# EAGLE design Qwiic Shield for RaspberryPi (EAGLE 7.7.0)
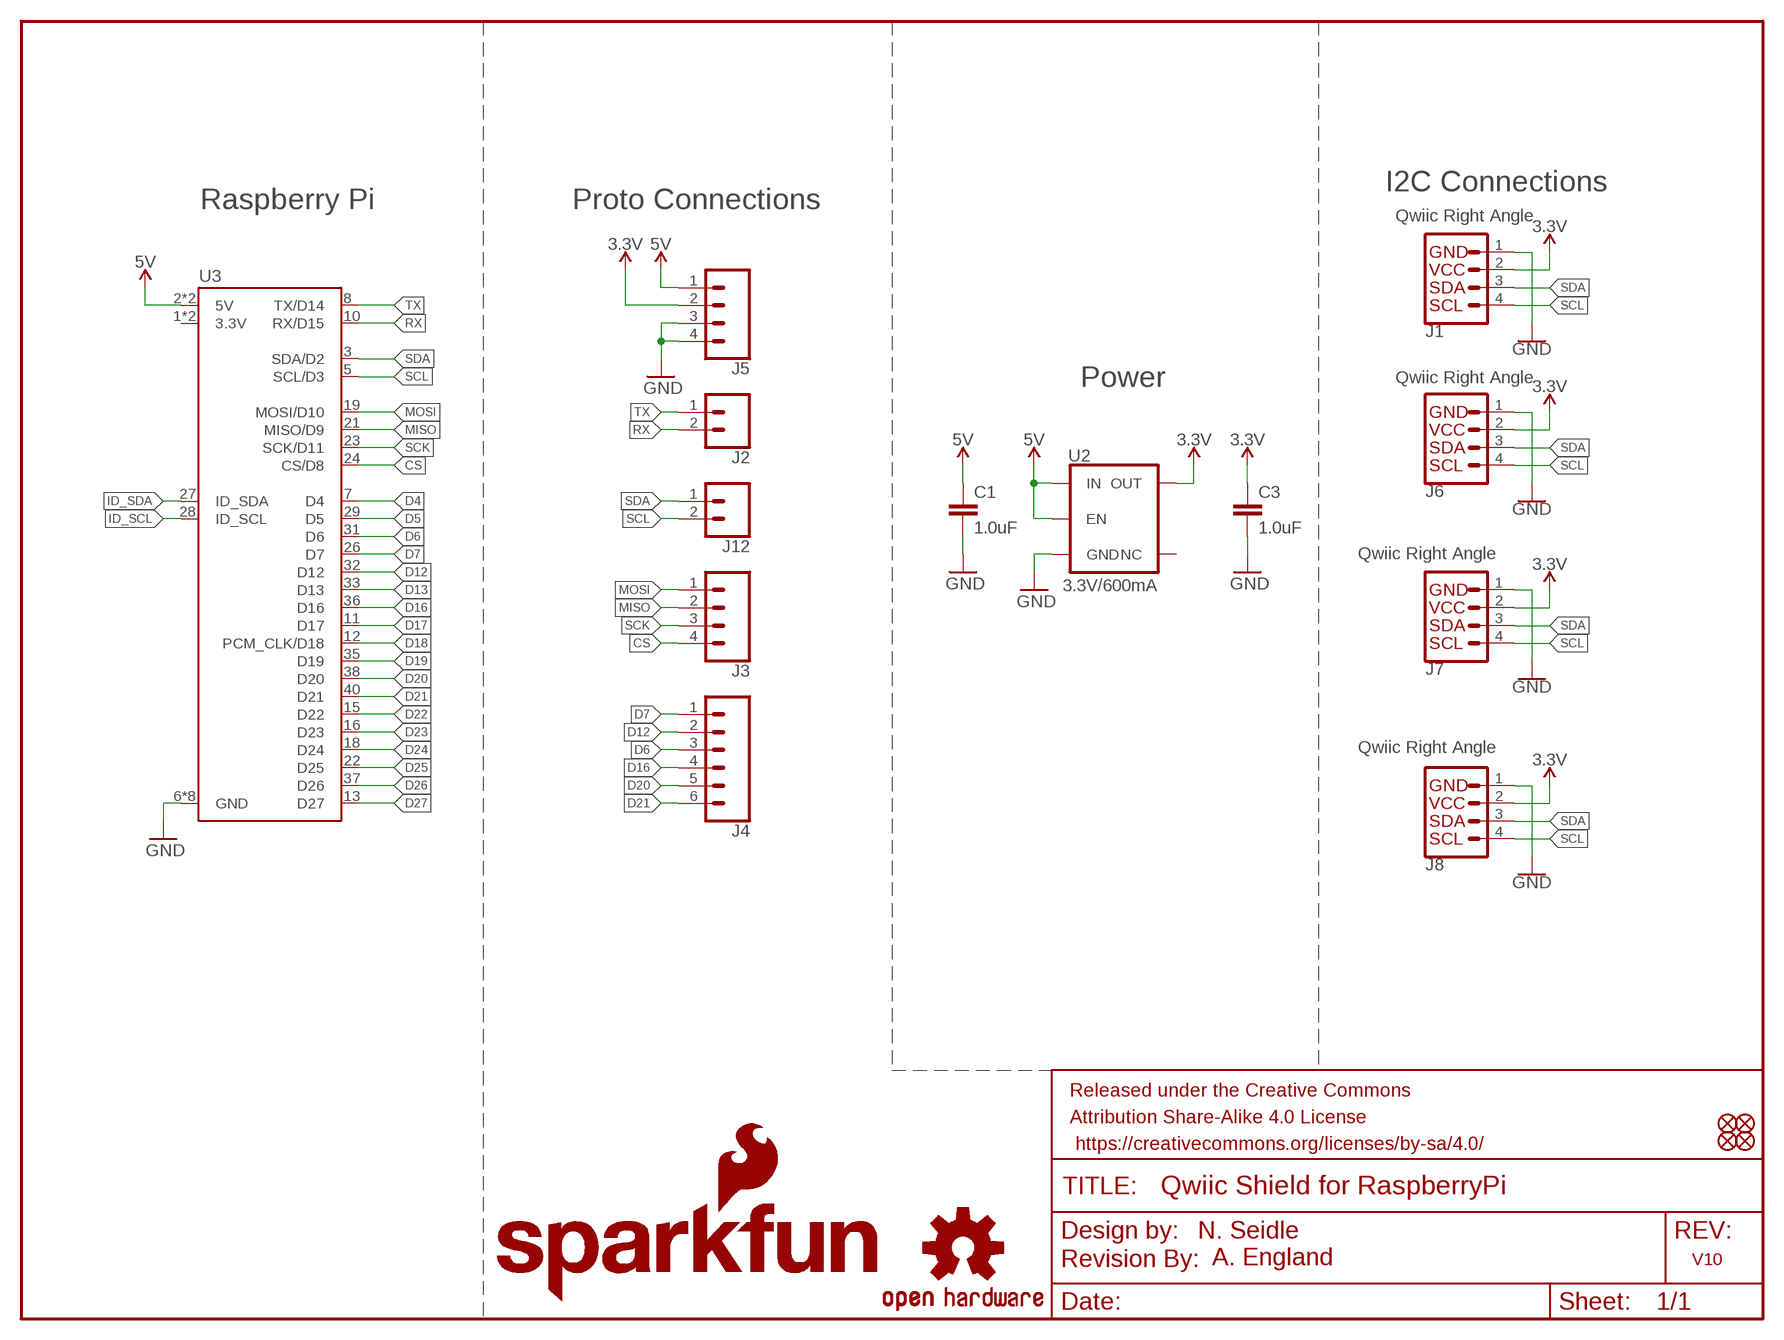
[diagram p0: schematic, sheet 1]

## Parts
C1  1.0uF  1.0UF-0603-16V-10%  [0603]
C3  1.0uF  1.0UF-0603-16V-10%  [0603]
FD1  FIDUCIAL1X2  [FIDUCIAL-1X2]
FD2  FIDUCIAL1X2  [FIDUCIAL-1X2]
FD3  FIDUCIAL1X2  [FIDUCIAL-1X2]
FD4  FIDUCIAL1X2  [FIDUCIAL-1X2]
FRAME1  FRAME-LETTER  [CREATIVE_COMMONS]
J1  Qwiic Right Angle  I2C_STANDARDQWIIC  [1X04_1MM_RA]
J2  CONN_021X02_NO_SILK  [1X02_NO_SILK]
J3  CONN_041X04_NO_SILK  [1X04_NO_SILK]
J4  CONN_06NO_SILK_FEMALE_PTH  [1X06_NO_SILK]
J5  CONN_041X04_NO_SILK  [1X04_NO_SILK]
J6  Qwiic Right Angle  I2C_STANDARDQWIIC  [1X04_1MM_RA]
J7  Qwiic Right Angle  I2C_STANDARDQWIIC  [1X04_1MM_RA]
J8  Qwiic Right Angle  I2C_STANDARDQWIIC  [1X04_1MM_RA]
J12  CONN_021X02_NO_SILK  [1X02_NO_SILK]
LOGO1  OSHW-LOGOMINI  [OSHW-LOGO-MINI]
LOGO2  REVISION  [REVISION]
U2  3.3V/600mA  V_REG_AP2112K-3.3V  [SOT23-5]
U3  RASPBERRY_PI_40BTM-NOHOLES  [RASPBERRY_PI_SHIELD_BOTTOM_ENTRY_NOHOLES]
U$1  SFE_LOGO_FLAME.1_INCH  [SFE_LOGO_FLAME_.1]
U$2  SFE_LOGO_NAME.1_INCH  [SFE_LOGO_NAME_.1]

## Nets
3.3V: C3.1 J1.2 J5.2 J6.2 J7.2 J8.2 U2.5(OUT)
5V: C1.1 J5.1 U2.1(IN) U2.3(EN) U3.2(5V) U3.4(5V)
CS: J3.4 U3.24(CS/D8)
D4: U3.7(D4)
D5: U3.29(D5)
D6: J4.3 U3.31(D6)
D7: J4.1 U3.26(D7)
D12: J4.2 U3.32(D12)
D13: U3.33(D13)
D16: J4.4 U3.36(D16)
D17: U3.11(D17)
D18: U3.12(PCM_CLK/D18)
D19: U3.35(D19)
D20: J4.5 U3.38(D20)
D21: J4.6 U3.40(D21)
D22: U3.15(D22)
D23: U3.16(D23)
D24: U3.18(D24)
D25: U3.22(D25)
D26: U3.37(D26)
D27: U3.13(D27)
GND [vcc]: C1.2 C3.2 J1.1 J5.3 J5.4 J6.1 J7.1 J8.1 U2.2(GND) U3.6(GND) U3.9(GND) U3.14(GND) U3.20(GND) U3.25(GND) U3.30(GND) U3.34(GND) U3.39(GND)
ID_SCL: U3.28(ID_SCL)
ID_SDA: U3.27(ID_SDA)
MISO: J3.2 U3.21(MISO/D9)
MOSI: J3.1 U3.19(MOSI/D10)
RX: J2.2 U3.10(RX/D15)
SCK: J3.3 U3.23(SCK/D11)
SCL: J1.4 J6.4 J7.4 J8.4 J12.2 U3.5(SCL/D3)
SDA: J1.3 J6.3 J7.3 J8.3 J12.1 U3.3(SDA/D2)
TX: J2.1 U3.8(TX/D14)
Unconnected: U2.4(NC) U3.1(3.3V) U3.17(3.3V)

## Notes on the sheet
- I2C Connections
- Raspberry Pi | Proto Connections
- Power
- N. Seidle
- A. England | V10

## Library data of the parts
C1 C3 = SparkFun-Capacitors:1.0UF: 1µF ceramic capacitors A capacitor is a passive two-terminal electrical component used to store electrical energy temporarily in an electric field.; PROD_ID: CAP-00868
FD1-FD4 = SparkFun-Aesthetics:FIDUCIAL: Fiducial Alignment Points Various fiducial points for machine vision alignment.
FRAME1 = SparkFun-Aesthetics:FRAME-LETTER: Schematic Frame Standard 8.5x11 US Letter frame
J1 J6-J8 = SparkFun-Connectors:I2C_STANDARD: SparkFun I2C Standard Pinout Header SparkFun has standardized on a pinout for all I2C based sensor breakouts. This pinout allows I2C boards to be plugged directly into the headers on Arduino Uno compatible boards, and to be daisy chained easily. Example SparkFun Products: SparkFun Atmospheric Sensor Breakout - BME280 <https://www.sparkfun.com/products/13676> SparkFun Altitude/Pressure Sensor Breakout - MPL3115A2 <https://www.sparkfun.com/products/11084> SparkFun TOF Range Finder Sensor - VL6180 <https://www.sparkfun.com/products/12785>; PROD_ID: CONN-13694
J2 J12 = SparkFun-Connectors:CONN_02: Multi connection point. Often used as Generic Header-pin footprint for 0.1 inch spaced/style header connections On any of the 0.1 inch spaced packages, you can populate with these: Break Away Headers - Straight <https://www.sparkfun.com/products/116> (PRT-00116) Break Away Male Headers - Right Angle <https://www.sparkfun.com/products/553> (PRT-00553) Female Headers <https://www.sparkfun.com/products/115> (PRT-00115) Break Away Headers - Machine Pin <https://www.sparkfun.com/products/117> (PRT-00117) Break Away Female Headers - Swiss Machine Pin <https://www.sparkfun.com/products/743> (PRT-00743) For SCREWTERMINALS and SPRING TERMINALS visit here: Screw Terimnals on SparkFun.com <https://www.sparkfun.com/search/results?term=Screw+Terminals> (5mm/3.5mm/2.54mm spacing) This device is also useful as a general connection point to wire up your design to another part of your project. Our various solder wires solder well into these plated through hole pads. Hook-Up Wire - Assortment (Stranded, 22 AWG) <https://www.sparkfun.com/products/11375> (PRT-11375) Hook-Up Wire - Assortment (Solid Core, 22 AWG) <https://www.sparkfun.com/products/11367> (PRT-11367) View the entire wire category on our website here <https://www.sparkfun.com/categories/141> Special notes: Molex polarized connector foot print use with: PRT-08233 with associated crimp pins and housings. 2.54_SCREWTERM for use with PRT-10571. 3.5mm Screw Terminal footprints for PRT-08084 5mm Screw Terminal footprints for use with PRT-08432
J3 J5 = SparkFun-Connectors:CONN_04: Multi connection point. Often used as Generic Header-pin footprint for 0.1 inch spaced/style header connections On any of the 0.1 inch spaced packages, you can populate with these: Break Away Headers - Straight <https://www.sparkfun.com/products/116> (PRT-00116) Break Away Male Headers - Right Angle <https://www.sparkfun.com/products/553> (PRT-00553) Female Headers <https://www.sparkfun.com/products/115> (PRT-00115) Break Away Headers - Machine Pin <https://www.sparkfun.com/products/117> (PRT-00117) Break Away Female Headers - Swiss Machine Pin <https://www.sparkfun.com/products/743> (PRT-00743) For SCREWTERMINALS and SPRING TERMINALS visit here: Screw Terimnals on SparkFun.com <https://www.sparkfun.com/search/results?term=Screw+Terminals> (5mm/3.5mm/2.54mm spacing) This device is also useful as a general connection point to wire up your design to another part of your project. Our various solder wires solder well into these plated through hole pads. Hook-Up Wire - Assortment (Stranded, 22 AWG) <https://www.sparkfun.com/products/11375> (PRT-11375) Hook-Up Wire - Assortment (Solid Core, 22 AWG) <https://www.sparkfun.com/products/11367> (PRT-11367) View the entire wire category on our website here <https://www.sparkfun.com/categories/141> Special notes: Molex polarized connector foot print use with SKU : PRT-08231 with associated crimp pins and housings. 1MM SMD Version SKU: PRT-10208; PROD_ID: CONN-09696
J4 = SparkFun-Connectors:CONN_06: Multi connection point. Often used as Generic Header-pin footprint for 0.1 inch spaced/style header connections On any of the 0.1 inch spaced packages, you can populate with these: Break Away Headers - Straight <https://www.sparkfun.com/products/116> (PRT-00116) Break Away Male Headers - Right Angle <https://www.sparkfun.com/products/553> (PRT-00553) Female Headers <https://www.sparkfun.com/products/115> (PRT-00115) Break Away Headers - Machine Pin <https://www.sparkfun.com/products/117> (PRT-00117) Break Away Female Headers - Swiss Machine Pin <https://www.sparkfun.com/products/743> (PRT-00743) Arduino Stackable Header - 6 Pin <https://www.sparkfun.com/products/9280> (PRT-09280) For SCREWTERMINALS and SPRING TERMINALS visit here: Screw Terimnals on SparkFun.com <https://www.sparkfun.com/search/results?term=Screw+Terminals> (5mm/3.5mm/2.54mm spacing) This device is also useful as a general connection point to wire up your design to another part of your project. Our various solder wires solder well into these plated through hole pads. Hook-Up Wire - Assortment (Stranded, 22 AWG) <https://www.sparkfun.com/products/11375> (PRT-11375) Hook-Up Wire - Assortment (Solid Core, 22 AWG) <https://www.sparkfun.com/products/11367> (PRT-11367) View the entire wire category on our website here <https://www.sparkfun.com/categories/141>; PROD_ID: CONN-08437
LOGO1 = SparkFun-Aesthetics:OSHW-LOGO: Open Source Hardware Logo This logo indicates the piece of hardware it is found on incorporates a OSHW license and/or adheres to the definition of open source hardware found here: http://freedomdefined.org/OSHW
LOGO2 = SparkFun-Aesthetics:REVISION: "Revision By" Text Preceding text for revisor documentation. Includes schematic text on "symbols" layer, and board text on tDoc.
U2 = SparkFun-IC-Power:V_REG_AP2112: AP2112 - 600mA CMOS LDO Regulator w/ Enable The AP2112 is CMOS process low dropout linear regulator with enable function, the regulator delivers a guaranteed 600mA (min.) continuous load current. Features Output Voltage Accuracy: ±1.5% Output Current: 600mA (Min.) Foldback Short Current Protection: 50mA Enable Function to Turn ON/OFF VOUT Low Dropout Voltage (3.3V): 250mV (Typ.) @IOUT=600mA Excellent Load Regulation: 0.2%/A (Typ.) Excellent Line Regulation: 0.02%/V (Typ.) Low Quiescent Current: 55μA (Typ.) Low Standby Current: 0.01μA (Typ.) Low Output Noise: 50μVRMS PSRR: 100Hz -65dB, 1kHz -65dB OTSD Protection Stable with 1.0μF Flexible Cap: Ceramic, Tantalum and Aluminum Electrolytic Operation Temperature Range: -40°C to 85°C ESD: MM 400V, HBM 4000V; PROD_ID: VREG-12457; VALUE: 3.3V
U3 = SparkFun-Connectors:RASPBERRY_PI_40; PROD_ID: CONN-13790
U$1 = SparkFun-Aesthetics:SFE_LOGO_FLAME: SparkFun Flame Logo This is the SparkFun flame logo. The logo on the schematic will always be the same size; the package variant is the height of the flame. Default layer for the logo on the board is tSilk.
U$2 = SparkFun-Aesthetics:SFE_LOGO_NAME: SparkFun Font Logo This is the SparkFun name logo. The logo on the schematic will always be the same size; the package variant is the height of the flame part of the logo (or the height the flame would be, if it were drawn). Default layer for the logo on the board is tSilk.

## Net classes
0 Default: width 0.178 mm
1 vcc: width 0.178 mm

## Board
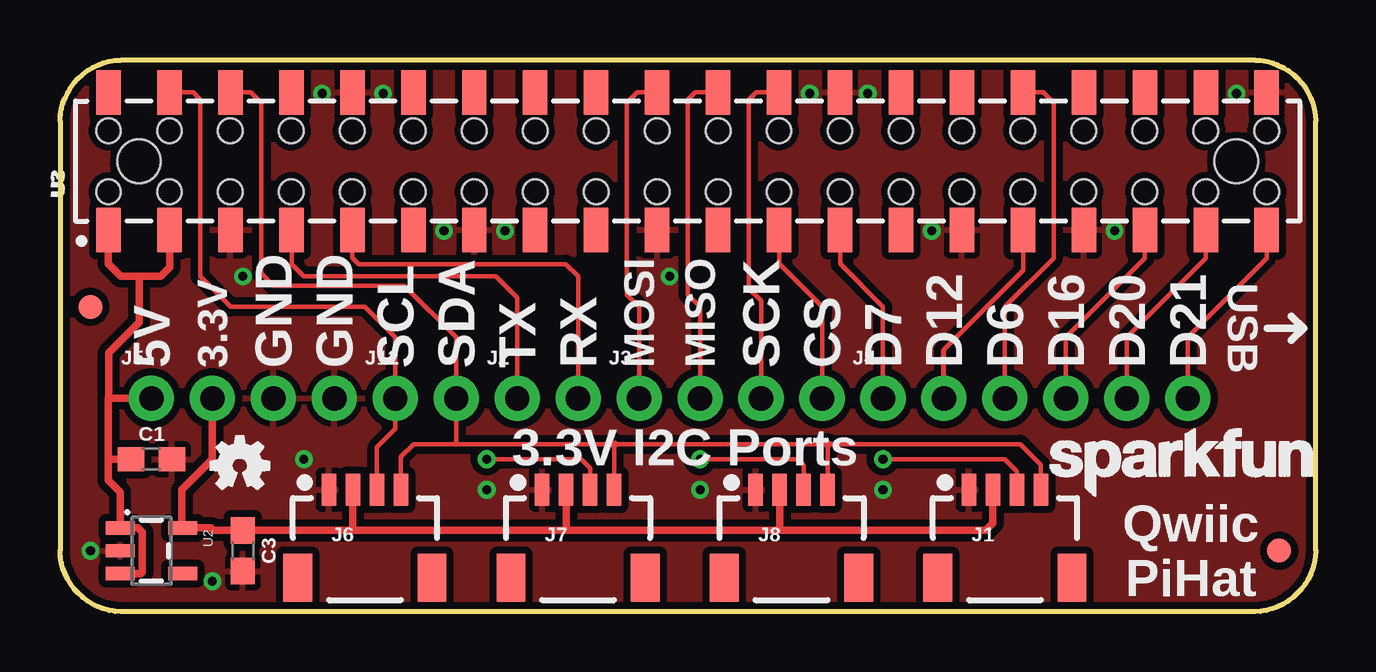
[diagram p1: board, top side]
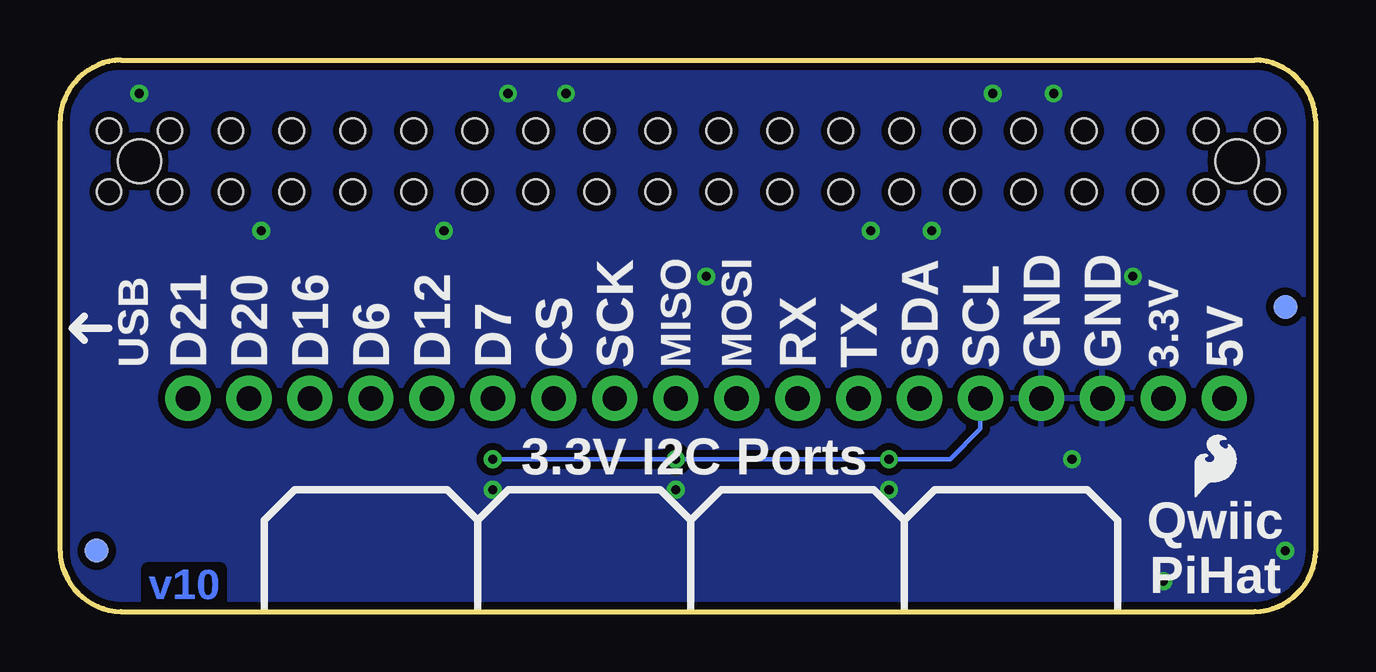
[diagram p2: board, bottom side, seen from below]

Size 52.32 x 22.99 mm. Coordinates in mm from the lower left corner, seen from the top.
Outline: 0,20.45 0,2.54 arc87 2.54,0 49.78,0 arc87 52.32,2.54 52.32,20.45 arc87 49.78,22.99 2.54,22.99 arc87 0,20.45
Copper layers (1*16): Top 0.035mm / dielectric 1.5mm / Bottom 0.035mm
Design rules "SparkFun-2-layer-TIGHT *": minimum track width 7mil, minimum drill 15mil, track to track 6mil, track to pad 6mil, pad to pad 6mil, via to via 6mil, smd to smd 6mil, copper to edge 7mil, drill to drill 7mil, minimum pad ring 7mil, minimum via ring 7mil, stop-mask expansion 4mil, vias tented up to drill 25mil, thermal gap 10mil

### Footprints (pad centres in the part's own frame; a part is rotated, then mirrored left to right if it is on the bottom)
0603 = smd 1.1 x 1: 1 -0.85,0; 2 0.85,0
FIDUCIAL-1X2 = smd 1 x 1: 1 0,0
1X04_1MM_RA = smd 0.6 x 1.35: 1 -1.5,0; 2 -0.5,0; 3 0.5,0; 4 1.5,0 | smd 1.2 x 2: NC1 2.8,-3.675; NC2 -2.8,-3.675
1X02_NO_SILK = drill 1.016 pad 1.88: 1 0,0; 2 2.54,0
1X04_NO_SILK = drill 1.016 pad 1.88: 1 0,0; 2 2.54,0; 3 5.08,0; 4 7.62,0
1X06_NO_SILK = drill 1.016 pad 1.88: 1 0,0; 2 2.54,0; 3 5.08,0; 4 7.62,0; 5 10.16,0; 6 12.7,0
SOT23-5 = smd 0.55 x 1.2: 1 -0.95,-1.3; 2 0,-1.3; 3 0.95,-1.3; 4 0.95,1.3; 5 -0.95,1.3
RASPBERRY_PI_SHIELD_BOTTOM_ENTRY_NOHOLES = smd 1.02 x 1.87: 1 8.37,7.665; 2 8.37,1.935; 3 10.91,7.665; 4 10.91,1.935; 5 13.45,7.665; 6 13.45,1.935; 7 15.99,7.665; 8 15.99,1.935; 9 18.53,7.665; 10 18.53,1.935; 11 21.07,7.665; 12 21.07,1.935; 13 23.61,7.665; 14 23.61,1.935; 15 26.15,7.665; 16 26.15,1.935; 17 28.69,7.665; 18 28.69,1.935; 19 31.23,7.665; 20 31.23,1.935; 21 33.77,7.665; 22 33.77,1.935; 23 36.31,7.665; 24 36.31,1.935; 25 38.85,7.665; 26 38.85,1.935; 27 41.39,7.665; 28 41.39,1.935; 29 43.93,7.665; 30 43.93,1.935; 31 46.47,7.665; 32 46.47,1.935; 33 49.01,7.665; 34 49.01,1.935; 35 51.55,7.665; 36 51.55,1.935; 37 54.09,7.665; 38 54.09,1.935; 39 56.63,7.665; 40 56.63,1.935 | hole 1.02: 31.23,6.07; 31.23,3.53; 28.69,3.53; 28.69,6.07; 26.15,6.07; 26.15,3.53; 23.61,3.53; 23.61,6.07; 36.31,6.07; 36.31,3.53; 33.77,3.53; 33.77,6.07; 15.99,6.07; 15.99,3.53; 13.45,3.53; 13.45,6.07; 10.91,6.07; 10.91,3.53; 8.37,3.53; 8.37,6.07; 21.07,6.07; 21.07,3.53; 18.53,3.53; 18.53,6.07; 46.47,6.07; 46.47,3.53; 43.93,3.53; 43.93,6.07; 41.39,6.07; 41.39,3.53; 38.85,3.53; 38.85,6.07; 51.55,6.07; 51.55,3.53; 49.01,3.53; 49.01,6.07; 54.09,6.07; 56.63,6.07; 56.63,3.53; 54.09,3.53 | hole 1.8: 55.36,4.8; 9.64,4.8

### Placement (x,y rotation side)
C1  3.81,6.35 0 top
C3  7.62,2.54 270 top
FD1  1.27,12.7 180 top
FD2  50.8,2.54 180 top
FD3  50.8,2.54 0 bottom
FD4  1.27,12.7 0 bottom
FRAME1  -8.89,-24.13 0 top  (outside the outline)
J1  39.37,5.08 0 top
J2  19.05,8.89 0 top
J3  24.13,8.89 0 top
J4  34.29,8.89 0 top
J5  3.81,8.89 0 top
J6  12.7,5.08 0 top
J7  21.59,5.08 0 top
J8  30.48,5.08 0 top
J12  13.97,8.89 0 top
LOGO1  7.49,6.1 0 top
LOGO2  2.54,-26.67 0 top  (outside the outline)
U2  3.81,2.54 270 top
U3  -6.35,13.97 0 top
U$1  5.33,4.45 0 bottom
U$2  40.77,4.32 0 top

### Tracks (layer width: path | path; a pad name or v marks a point on that pad's centre or on a via)
3.3V
  Top 0.305: 12.19,3.39 C3.1 6.39,3.39 6.29,3.49 U2.5 5.08,3.52 5.08,5.08 6.35,6.35 J5.2 | 12.19,3.39 21.08,3.39 | 21.08,3.39 29.97,3.39 | 29.97,3.39 38.57,3.39 38.87,3.69 J1.2 | J8.2 29.98,3.4 29.97,3.39 | J7.2 21.09,3.4 21.08,3.39 | J6.2 12.2,3.4 12.19,3.39
5V
  Top 0.305: 2.02,6.35 2.02,8.89 2.03,8.89 | 2.02,6.35 2.02,5.47 2.51,4.98 U2.1 3.24,3.49 3.43,3.3 3.43,1.65 3.37,1.59 U2.3 | J5.1 2.03,8.89 | C1.1 2.02,6.35 | 2.03,8.89 2.03,10.79 3.3,12.06 3.3,13.97 | U3.2 2.02,14.49 2.54,13.97 3.3,13.97 | 3.3,13.97 4.19,13.97 4.57,14.35 4.57,15.89 U3.4
CS
  Top 0.178: U3.24 29.96,14.49 31.75,12.7 J3.4
D6
  Top 0.178: J4.3 39.37,12.7 41.4,14.73 41.4,21.21 40.98,21.64 U3.31
D7
  Top 0.178: J4.1 34.29,12.7 32.5,14.49 U3.26
D12
  Top 0.178: 36.83,10.92 40.13,14.22 40.13,15.89
  Top 0.203: J4.2 36.83,10.92 | 40.13,15.89 U3.32
D16
  Top 0.178: J4.4 41.91,11.43 45.2,14.72 U3.36
D20
  Top 0.178: J4.5 44.45,11.43 47.74,14.72 U3.38
D21
  Top 0.178: J4.6 46.99,11.43 50.28,14.72 U3.40
GND  (via drill 0.38)
  other vias: 10.16,6.35 1.27,2.54 17.78,5.08 26.67,5.08 34.29,5.08 7.62,13.97 25.4,13.97 10.92,21.59 13.46,21.59 16,15.88 18.54,15.88 31.24,21.59 33.66,21.59 36.32,15.88 43.94,15.88 49.02,21.59 6.35,1.27
  pour Top (isolate 0.305): 0,22.86 52.07,22.86 52.07,0 0,0
  pour Bottom (isolate 0.305): 0,22.86 52.07,22.86 52.07,0 0,0
MISO
  Top 0.178: U3.21 26.46,21.64 26.16,21.34 26.16,13.21 26.67,12.7 J3.2
MOSI
  Top 0.178: J3.1 24.13,12.7 23.62,13.21 23.62,21.21 24.05,21.64 U3.19
RX
  Top 0.178: U3.10 12.18,14.74 12.45,14.48 21.08,14.48 21.59,13.97 J2.2
SCK
  Top 0.178: J3.3 29.21,12.95 28.7,13.46 28.7,21.34 29,21.64 U3.23
SCL
  Top 0.178: J6.4 14.2,6.45 14.73,6.99 16.51,6.99 | 16.51,6.99 23.11,6.99 32,6.99 40.01,6.99 40.87,6.12 J1.4 | J8.4 31.98,6.96 | J7.4 23.09,6.96 | 16.51,6.99 J12.2 16.51,11.43 14.35,13.59 8.89,13.59 8.38,14.1 8.38,21.21 7.96,21.64 U3.5
  Top 0.305: 31.98,6.96 32,6.99 | 23.09,6.96 23.11,6.99
SDA  (via drill 0.38)
  Top 0.178: J6.3 13.2,6.85 13.97,7.62 J12.1 13.97,11.43 12.7,12.7 7.11,12.7 5.84,13.97 5.84,21.34 5.54,21.64 U3.3 | J1.3 39.87,5.85 39.37,6.35 v34.29,6.35 | J7.3 22.09,5.98 21.72,6.35 v17.78,6.35 | J8.3 30.98,6.1 30.73,6.35 v26.67,6.35
  Bottom 0.178: v34.29,6.35 v26.67,6.35 v17.78,6.35 15.24,6.35 13.97,7.62 J12.1
TX
  Top 0.178: J2.1 19.05,13.08 18.16,13.97 10.16,13.97 9.65,14.48 9.65,15.89 U3.8

### Text on the board
Bottom: v10
tPlace: USB | 5V | 3.3V | GND | GND | SCL | SDA | TX | RX | MOSI | MISO | SCK | CS | D7 | D12 | D6 | D16 | D20 | D21 | 3.3V I2C Ports | Qwiic / PiHat
bPlace: USB | 5V | 3.3V | GND | GND | SCL | SDA | TX | RX | MOSI | MISO | SCK | CS | D7 | D12 | D6 | D16 | D20 | D21 | 3.3V I2C Ports | Qwiic / PiHat
tDocu: N. Seidle | A. England